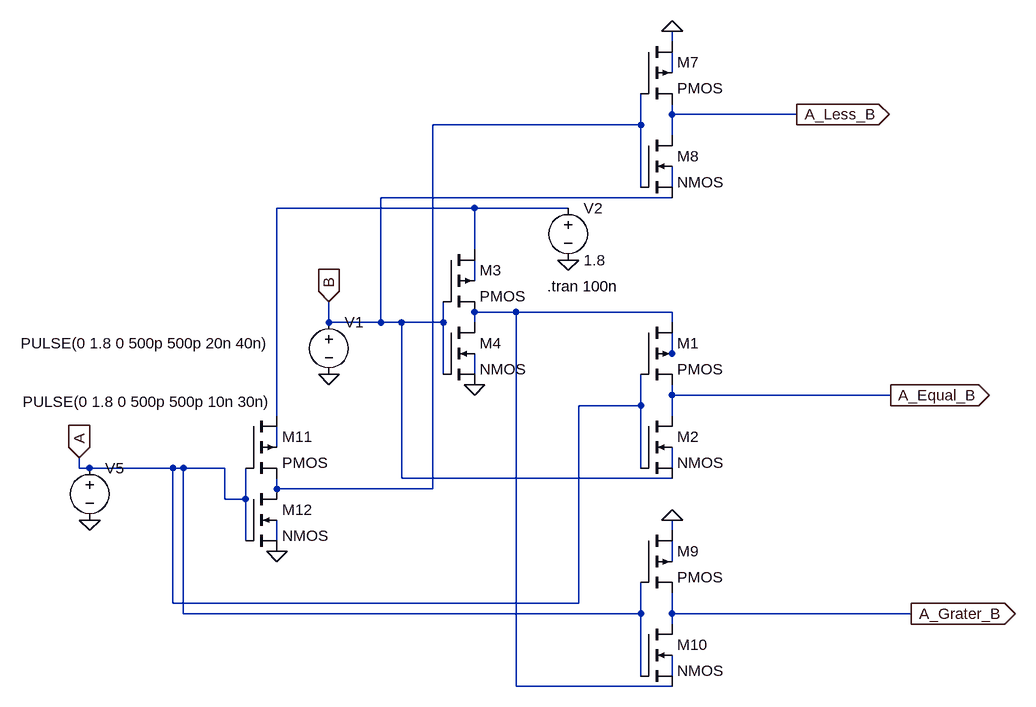
[diagram p0: schematic GDI_Comparator.asc]
GDI_Comparator.asc, the LTspice schematic file:
Version 4
SHEET 1 880 728
WIRE 304 -272 304 -288
WIRE 304 -224 304 -256
WIRE 304 -160 304 -176
WIRE 496 -160 304 -160
WIRE 256 -144 256 -192
WIRE 256 -144 -64 -144
WIRE 304 -128 304 -160
WIRE 256 -48 256 -144
WIRE 304 -48 304 -80
WIRE 304 -32 -144 -32
WIRE 0 -16 -304 -16
WIRE 144 -16 0 -16
WIRE 0 48 0 -16
WIRE 0 96 0 64
WIRE 64 144 0 144
WIRE 304 144 64 144
WIRE -224 160 -224 128
WIRE -144 160 -144 -32
WIRE -144 160 -224 160
WIRE -112 160 -144 160
WIRE -48 160 -48 128
WIRE -48 160 -112 160
WIRE 0 160 0 144
WIRE 304 160 304 144
WIRE 304 208 304 176
WIRE 304 208 288 208
WIRE -48 240 -48 160
WIRE 0 240 0 208
WIRE 304 272 304 256
WIRE 640 272 304 272
WIRE 256 288 256 240
WIRE 256 288 160 288
WIRE -304 304 -304 -16
WIRE 304 304 304 272
WIRE -304 352 -304 320
WIRE -608 384 -608 368
WIRE -592 384 -608 384
WIRE -464 384 -592 384
WIRE -448 384 -464 384
WIRE -384 384 -448 384
WIRE 256 384 256 288
WIRE 304 384 304 352
WIRE -112 400 -112 160
WIRE 304 400 -112 400
WIRE -304 416 -304 400
WIRE -64 416 -64 -144
WIRE -64 416 -304 416
WIRE -384 432 -384 384
WIRE -352 432 -352 384
WIRE -352 432 -384 432
WIRE 304 480 304 464
WIRE -352 496 -352 432
WIRE -304 496 -304 464
WIRE 304 528 304 496
WIRE -464 592 -464 384
WIRE 160 592 160 288
WIRE 160 592 -464 592
WIRE -448 608 -448 384
WIRE 256 608 256 560
WIRE 256 608 -448 608
WIRE 304 608 304 576
WIRE 672 608 304 608
WIRE 304 624 304 608
WIRE 256 704 256 608
WIRE 304 704 304 672
WIRE 64 720 64 144
WIRE 304 720 64 720
FLAG -224 240 0
FLAG -224 128 B
IOPIN -224 128 In
FLAG 144 64 0
FLAG 0 256 0
FLAG 640 272 A_Equal_B
IOPIN 640 272 Out
FLAG 304 -288 0
FLAG 304 464 0
FLAG -304 512 0
FLAG -592 464 0
FLAG -608 368 A
IOPIN -608 368 In
FLAG 496 -160 A_Less_B
IOPIN 496 -160 Out
FLAG 672 608 A_Grater_B
IOPIN 672 608 Out
SYMBOL pmos4 256 160 R0
SYMATTR InstName M1
SYMBOL nmos4 256 304 R0
SYMATTR InstName M2
SYMBOL pmos4 -48 48 R0
SYMATTR InstName M3
SYMBOL nmos4 -48 160 R0
SYMATTR InstName M4
SYMBOL voltage -224 144 R0
WINDOW 3 -474 48 Left 2
WINDOW 123 0 0 Left 0
WINDOW 39 0 0 Left 0
SYMATTR Value PULSE(0 1.8 0 500p 500p 20n 40n)
SYMATTR InstName V1
SYMBOL voltage 144 -32 R0
WINDOW 123 0 0 Left 0
WINDOW 39 0 0 Left 0
SYMATTR InstName V2
SYMATTR Value 1.8
SYMBOL pmos4 256 -272 R0
SYMATTR InstName M7
SYMBOL nmos4 256 -128 R0
SYMATTR InstName M8
SYMBOL pmos4 256 480 R0
SYMATTR InstName M9
SYMBOL nmos4 256 624 R0
SYMATTR InstName M10
SYMBOL pmos4 -352 304 R0
SYMATTR InstName M11
SYMBOL nmos4 -352 416 R0
SYMATTR InstName M12
SYMBOL voltage -592 368 R0
WINDOW 3 -103 -86 Left 2
WINDOW 123 0 0 Left 0
WINDOW 39 0 0 Left 0
SYMATTR Value PULSE(0 1.8 0 500p 500p 10n 30n)
SYMATTR InstName V5
TEXT 112 104 Left 2 !.tran 100n

The netlist it stands for:
* GDI_Comparator.asc
M1 N006 A A_Equal_B N007 PMOS
M2 A_Equal_B A B N010 NMOS
M3 N004 B N006 N005 PMOS
M4 N006 B 0 N008 NMOS
V1 B 0 PULSE(0 1.8 0 500p 500p 20n 40n)
V2 N004 0 1.8
M7 0 N002 A_Less_B N001 PMOS
M8 A_Less_B N002 B N003 NMOS
M9 0 A A_Grater_B N012 PMOS
M10 A_Grater_B A N006 N013 NMOS
M11 N004 A N002 N009 PMOS
M12 N002 A 0 N011 NMOS
V5 A 0 PULSE(0 1.8 0 500p 500p 10n 30n)
.model NMOS NMOS
.model PMOS PMOS
.lib standard.mos
.tran 100n
.backanno
.end